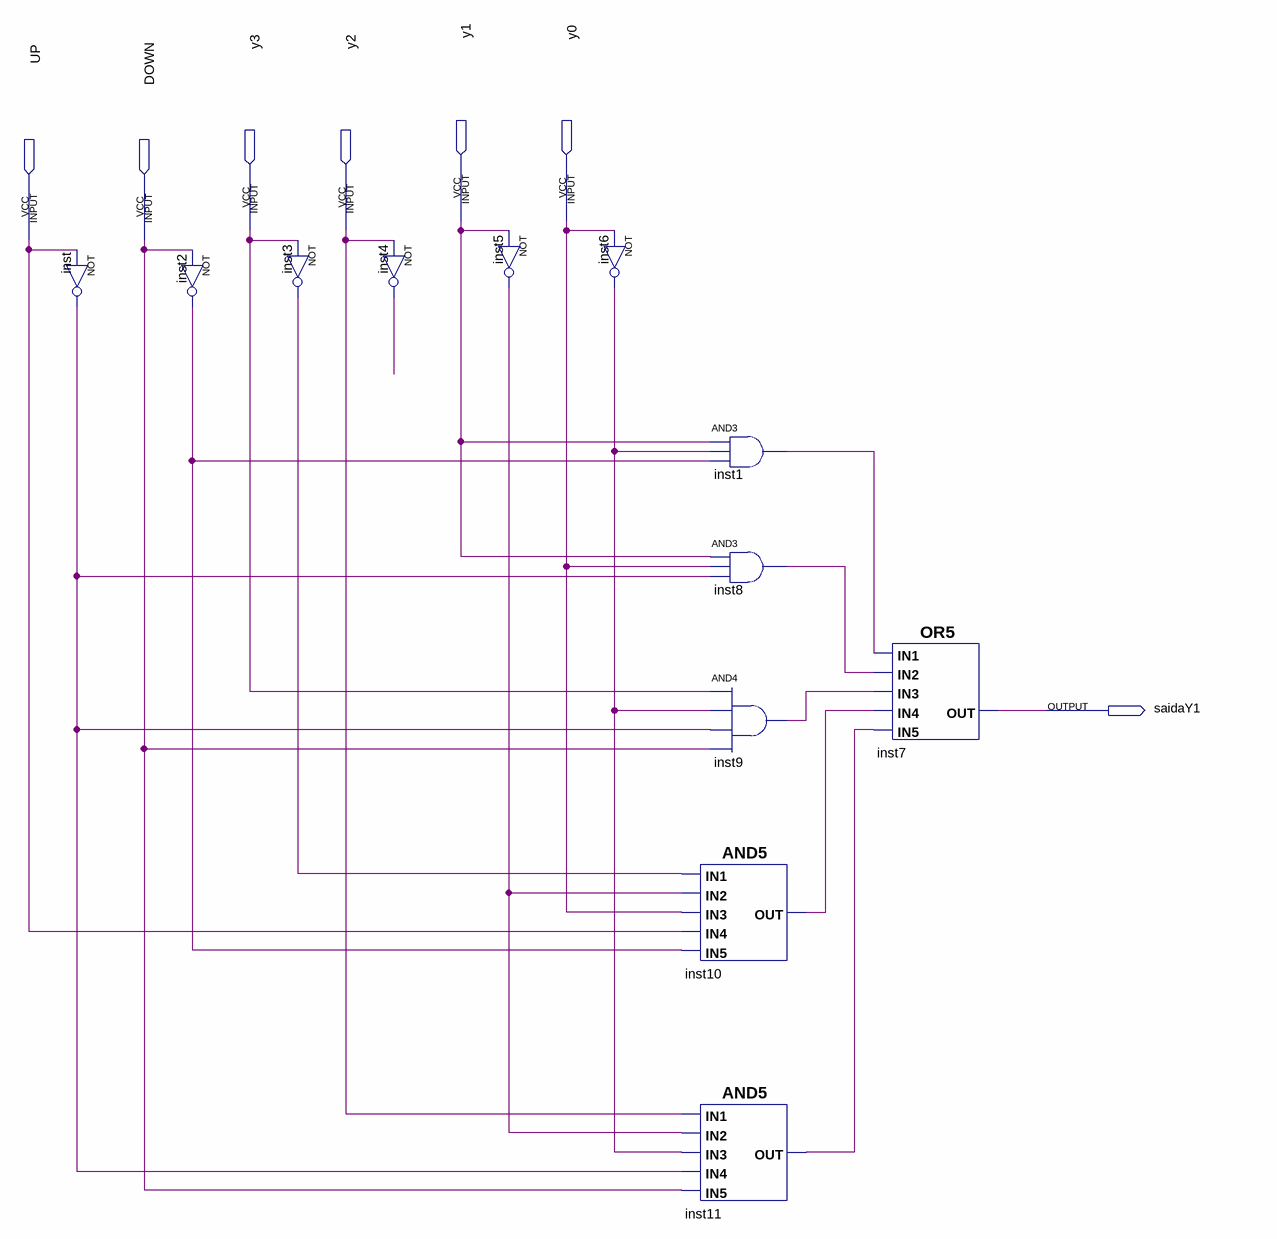
[diagram p0: schematic sheet]
// Quartus schematic Y1.bdf as structural Verilog: 12 symbols, 7 pins
module Y1 (
  input  y1,
  input  y0,
  input  y3,
  input  y2,
  input  UP,
  input  DOWN,
  output saidaY1
);

  wire inst1_out, inst2_out, inst3_out, inst4_out, inst5_out, inst6_out, inst8_out, inst9_out, inst10_out,
       inst11_out, inst_out;

  not inst (inst_out, UP);
  not inst2 (inst2_out, DOWN);
  not inst3 (inst3_out, y3);
  not inst4 (inst4_out, y2);
  not inst5 (inst5_out, y1);
  not inst6 (inst6_out, y0);
  and inst1 (inst1_out, y1, inst6_out, inst2_out);
  and inst8 (inst8_out, y1, y0, inst_out);
  and inst9 (inst9_out, y3, inst6_out, inst_out, DOWN);
  and inst10 (inst10_out, inst3_out, inst5_out, y0, UP, inst2_out);
  and inst11 (inst11_out, y2, inst5_out, inst6_out, inst_out, DOWN);
  or inst7 (saidaY1, inst1_out, inst8_out, inst9_out, inst10_out, inst11_out);
endmodule
